# Altium schematic sheet Pulse3.SchDoc
size A4
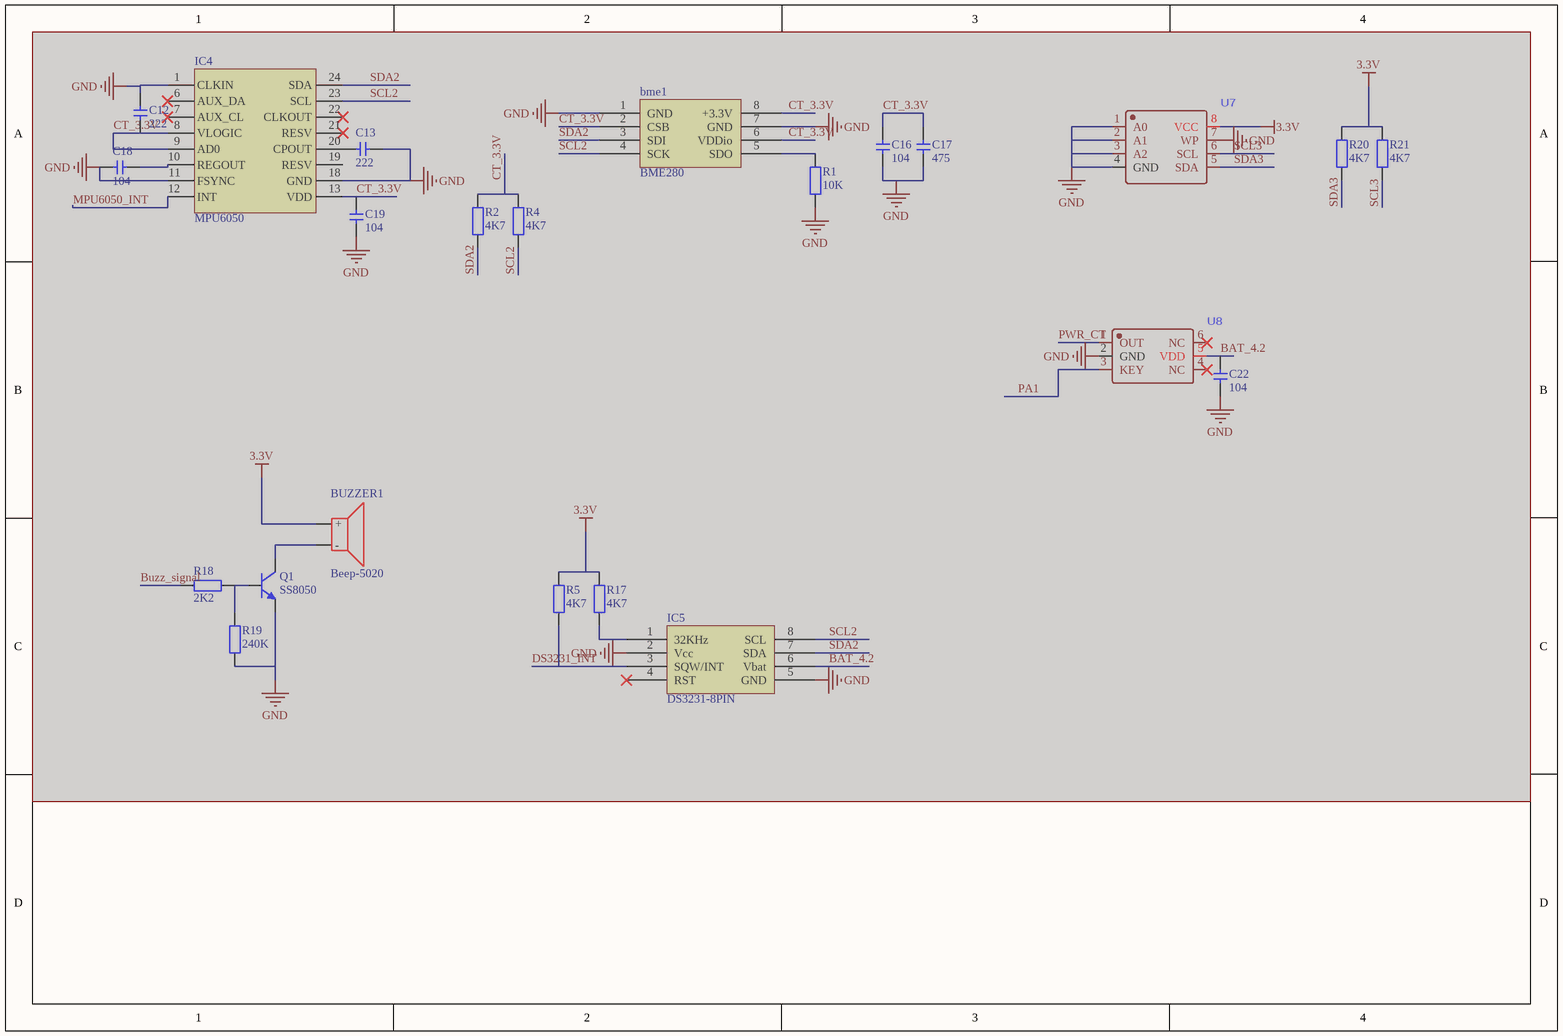
[diagram p0: Pulse3.SchDoc]

## Parts
bme1  BME280  [BME280]  (masked out: inside a compile mask, not in the netlist)
BUZZER1  Beep-5020  [5020BUZZER]  (masked out: inside a compile mask, not in the netlist)
C12  222  [C 0402_L]  (masked out: inside a compile mask, not in the netlist)
C13  222  [C 0402_L]  (masked out: inside a compile mask, not in the netlist)
C16  104  [C 0402_L]  (masked out: inside a compile mask, not in the netlist)
C17  475  [C 0402_L]  (masked out: inside a compile mask, not in the netlist)
C18  104  [C 0402_L]  (masked out: inside a compile mask, not in the netlist)
C19  104  [C 0402_L]  (masked out: inside a compile mask, not in the netlist)
C22  104  [C 0402_L]  (masked out: inside a compile mask, not in the netlist)
IC4  MPU6050  [QFN24 4x4_M]  (masked out: inside a compile mask, not in the netlist)
IC5  DS3231-8PIN  [SOP8_N]  (masked out: inside a compile mask, not in the netlist)
Q1  SS8050  [SOT23-3N]  (masked out: inside a compile mask, not in the netlist)
R1  10K  [R 0402_L]  (masked out: inside a compile mask, not in the netlist)
R2  4K7  [R 0402_L]  (masked out: inside a compile mask, not in the netlist)
R4  4K7  [R 0402_L]  (masked out: inside a compile mask, not in the netlist)
R5  4K7  [R 0402_L]  (masked out: inside a compile mask, not in the netlist)
R17  4K7  [R 0402_L]  (masked out: inside a compile mask, not in the netlist)
R18  2K2  [R 0402_L]  (masked out: inside a compile mask, not in the netlist)
R19  240K  [R 0402_L]  (masked out: inside a compile mask, not in the netlist)
R20  4K7  [R 0402_L]  (masked out: inside a compile mask, not in the netlist)
R21  4K7  [R 0402_L]  (masked out: inside a compile mask, not in the netlist)
U7  (no value)  [AT24C256]  (masked out: inside a compile mask, not in the netlist)
U8  (no value)  [EC190708]  (masked out: inside a compile mask, not in the netlist)

## Library data of the parts
bme1 = BME280: 气压，湿度，温度传感器
BUZZER1 = Beep-5020: 贴片蜂鸣器5020最小封装
C12 C13 C16-C19 C22 = C
IC4 = MPU6050: 陀螺仪
Q1 = 8050-SMD: 高频放大-NPN型; 版权归属: 源创客; 属性: 40V 1.5A 1W 100MHZ; BOM名称: 高频放大-NPN型; 学习资源: www.ooocke.com
R1 R2 R4 R5 R17-R21 = R: 贴片电阻; 版权归属: 来自淘宝 ID：黄晶宝石; BOM名称: 贴片电阻; 联系售后: https://shop463601444.taobao.com
U7 = AT24C256C-SSHL-T
U8 = EC190708